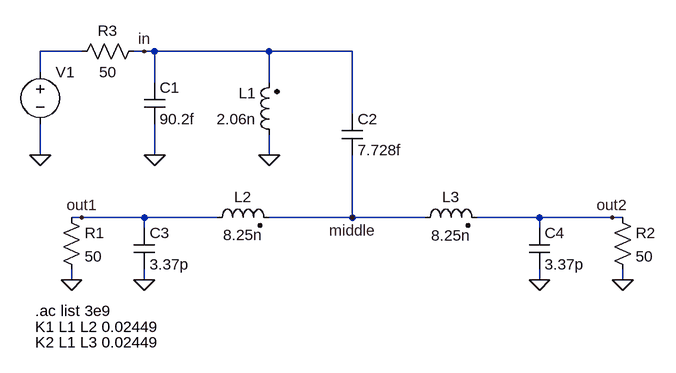
[diagram p0: schematic loop_eqc.asc]
loop_eqc.asc, the LTspice schematic file:
Version 4
SHEET 1 1276 680
WIRE 144 48 80 48
WIRE 240 48 224 48
WIRE 256 48 240 48
WIRE 432 48 256 48
WIRE 560 48 432 48
WIRE 80 80 80 48
WIRE 256 96 256 48
WIRE 432 96 432 48
WIRE 560 144 560 48
WIRE 80 208 80 160
WIRE 256 208 256 160
WIRE 432 208 432 176
WIRE 144 304 128 304
WIRE 240 304 144 304
WIRE 352 304 240 304
WIRE 560 304 560 208
WIRE 560 304 432 304
WIRE 672 304 560 304
WIRE 848 304 752 304
WIRE 960 304 848 304
WIRE 976 304 960 304
WIRE 240 320 240 304
WIRE 848 320 848 304
WIRE 128 400 128 384
WIRE 240 400 240 384
WIRE 848 400 848 384
WIRE 976 400 976 384
FLAG 80 208 0
FLAG 256 208 0
FLAG 240 400 0
FLAG 848 400 0
FLAG 128 400 0
FLAG 976 400 0
FLAG 144 304 out1
FLAG 240 48 in
FLAG 560 304 middle
FLAG 960 304 out2
FLAG 432 208 0
SYMBOL voltage 80 64 R0
WINDOW 39 0 0 Left 0
SYMATTR InstName V1
SYMATTR Value ""
SYMATTR Value2 AC 19.91679
SYMBOL cap 240 96 R0
SYMATTR InstName C1
SYMATTR Value 90.2f
SYMBOL ind2 448 192 R180
WINDOW 0 36 80 Left 2
WINDOW 3 36 40 Left 2
SYMATTR InstName L1
SYMATTR Value 2.06n
SYMATTR Type ind
SYMBOL cap 544 144 R0
SYMATTR InstName C2
SYMATTR Value 7.728f
SYMBOL ind2 336 320 R270
WINDOW 0 32 56 VTop 2
WINDOW 3 5 56 VBottom 2
SYMATTR InstName L2
SYMATTR Value 8.25n
SYMATTR Type ind
SYMBOL ind2 656 320 R270
WINDOW 0 32 56 VTop 2
WINDOW 3 4 56 VBottom 2
SYMATTR InstName L3
SYMATTR Value 8.25n
SYMATTR Type ind
SYMBOL cap 224 320 R0
SYMATTR InstName C3
SYMATTR Value 3.37p
SYMBOL cap 832 320 R0
SYMATTR InstName C4
SYMATTR Value 3.37p
SYMBOL res 112 288 R0
SYMATTR InstName R1
SYMATTR Value 50
SYMBOL res 960 288 R0
SYMATTR InstName R2
SYMATTR Value 50
SYMBOL res 240 32 R90
WINDOW 0 0 56 VBottom 2
WINDOW 3 32 56 VTop 2
SYMATTR InstName R3
SYMATTR Value 50
TEXT 72 448 Left 2 !.ac list 3e9
TEXT 72 472 Left 2 !K1 L1 L2 0.02449
TEXT 72 496 Left 2 !K2 L1 L3 0.02449

The netlist it stands for:
* loop_eqc.asc
V1 N001 0 AC 19.91679
C1 in 0 90.2f
L1 0 in 2.06n
C2 in middle 7.728f
L2 out1 middle 8.25n
L3 middle out2 8.25n
C3 out1 0 3.37p
C4 out2 0 3.37p
R1 out1 0 50
R2 out2 0 50
R3 in N001 50
.ac list 3e9
K1 L1 L2 0.02449
K2 L1 L3 0.02449
.backanno
.end